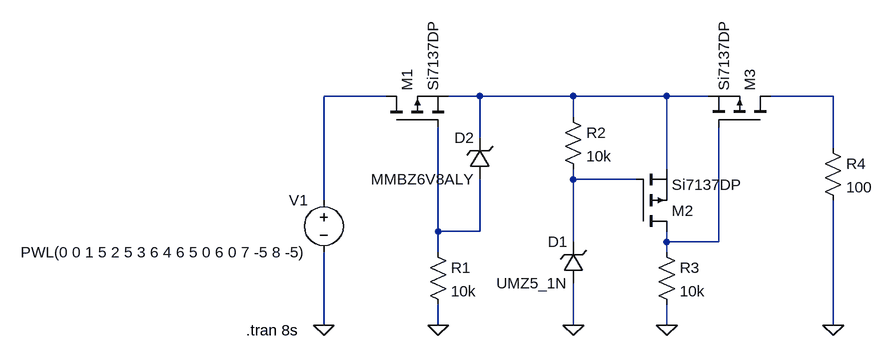
[diagram p0: schematic ReserveOverVoltageProtection.asc]
ReserveOverVoltageProtection.asc, the LTspice schematic file:
Version 4
SHEET 1 1444 680
WIRE 688 -48 592 -48
WIRE 832 -48 784 -48
WIRE 976 -48 832 -48
WIRE 1120 -48 976 -48
WIRE 1184 -48 1120 -48
WIRE 1376 -48 1280 -48
WIRE 976 -16 976 -48
WIRE 832 16 832 -48
WIRE 1376 32 1376 -48
WIRE 1120 64 1120 -48
WIRE 976 80 976 64
WIRE 1072 80 976 80
WIRE 592 112 592 -48
WIRE 768 160 768 0
WIRE 832 160 832 80
WIRE 832 160 768 160
WIRE 976 176 976 80
WIRE 1120 176 1120 160
WIRE 1200 176 1200 0
WIRE 1200 176 1120 176
WIRE 768 192 768 160
WIRE 1120 192 1120 176
WIRE 592 304 592 192
WIRE 768 304 768 272
WIRE 976 304 976 240
WIRE 1120 304 1120 272
WIRE 1376 304 1376 112
FLAG 592 304 0
FLAG 976 304 0
FLAG 768 304 0
FLAG 1376 304 0
FLAG 1120 304 0
SYMBOL voltage 592 96 M0
WINDOW 123 0 0 Left 0
WINDOW 39 0 0 Left 0
SYMATTR InstName V1
SYMATTR Value PWL(0 0 1 5 2 5 3 6 4 6 5 0 6 0 7 -5 8 -5)
SYMBOL zener 992 240 R180
WINDOW 0 24 64 Left 2
WINDOW 3 24 0 Left 2
SYMATTR InstName D1
SYMATTR Value UMZ5_1N
SYMBOL res 752 176 R0
SYMATTR InstName R1
SYMATTR Value 10k
SYMBOL res 960 -32 R0
SYMATTR InstName R2
SYMATTR Value 10k
SYMBOL zener 848 80 R180
WINDOW 0 24 64 Left 2
WINDOW 3 24 0 Left 2
SYMATTR InstName D2
SYMATTR Value MMBZ6V8ALY
SYMBOL pmos 688 0 R270
SYMATTR InstName M1
SYMATTR Value Si7137DP
SYMBOL pmos 1072 160 M180
SYMATTR InstName M2
SYMATTR Value Si7137DP
SYMBOL pmos 1280 0 M270
SYMATTR InstName M3
SYMATTR Value Si7137DP
SYMBOL res 1104 176 R0
SYMATTR InstName R3
SYMATTR Value 10k
SYMBOL res 1360 16 R0
SYMATTR InstName R4
SYMATTR Value 100
TEXT 472 312 Left 2 !.tran 8s

The netlist it stands for:
* ReserveOverVoltageProtection.asc
V1 N001 0 PWL(0 0 1 5 2 5 3 6 4 6 5 0 6 0 7 -5 8 -5)
D1 0 N004 UMZ5_1N
R1 N005 0 10k
R2 N002 N004 10k
D2 N005 N002 MMBZ6V8ALY
M1 N001 N005 N002 N002 Si7137DP
M2 N006 N004 N002 N002 Si7137DP
M3 N003 N006 N002 N002 Si7137DP
R3 N006 0 10k
R4 N003 0 100
.model D D
.lib standard.dio
.model NMOS NMOS
.model PMOS PMOS
.lib standard.mos
.tran 8s
.backanno
.end